# EasyEDA Pro project 一体板.epro, schematic Schematic2
Create Date: 2023-07-03; Page Name: P1; Project Name: 独轮车七月; Schematic Name: Schematic2; Update Date: 2023-07-03; Company: 嘉立创EDA; Page Size: A4; Version: V1.0
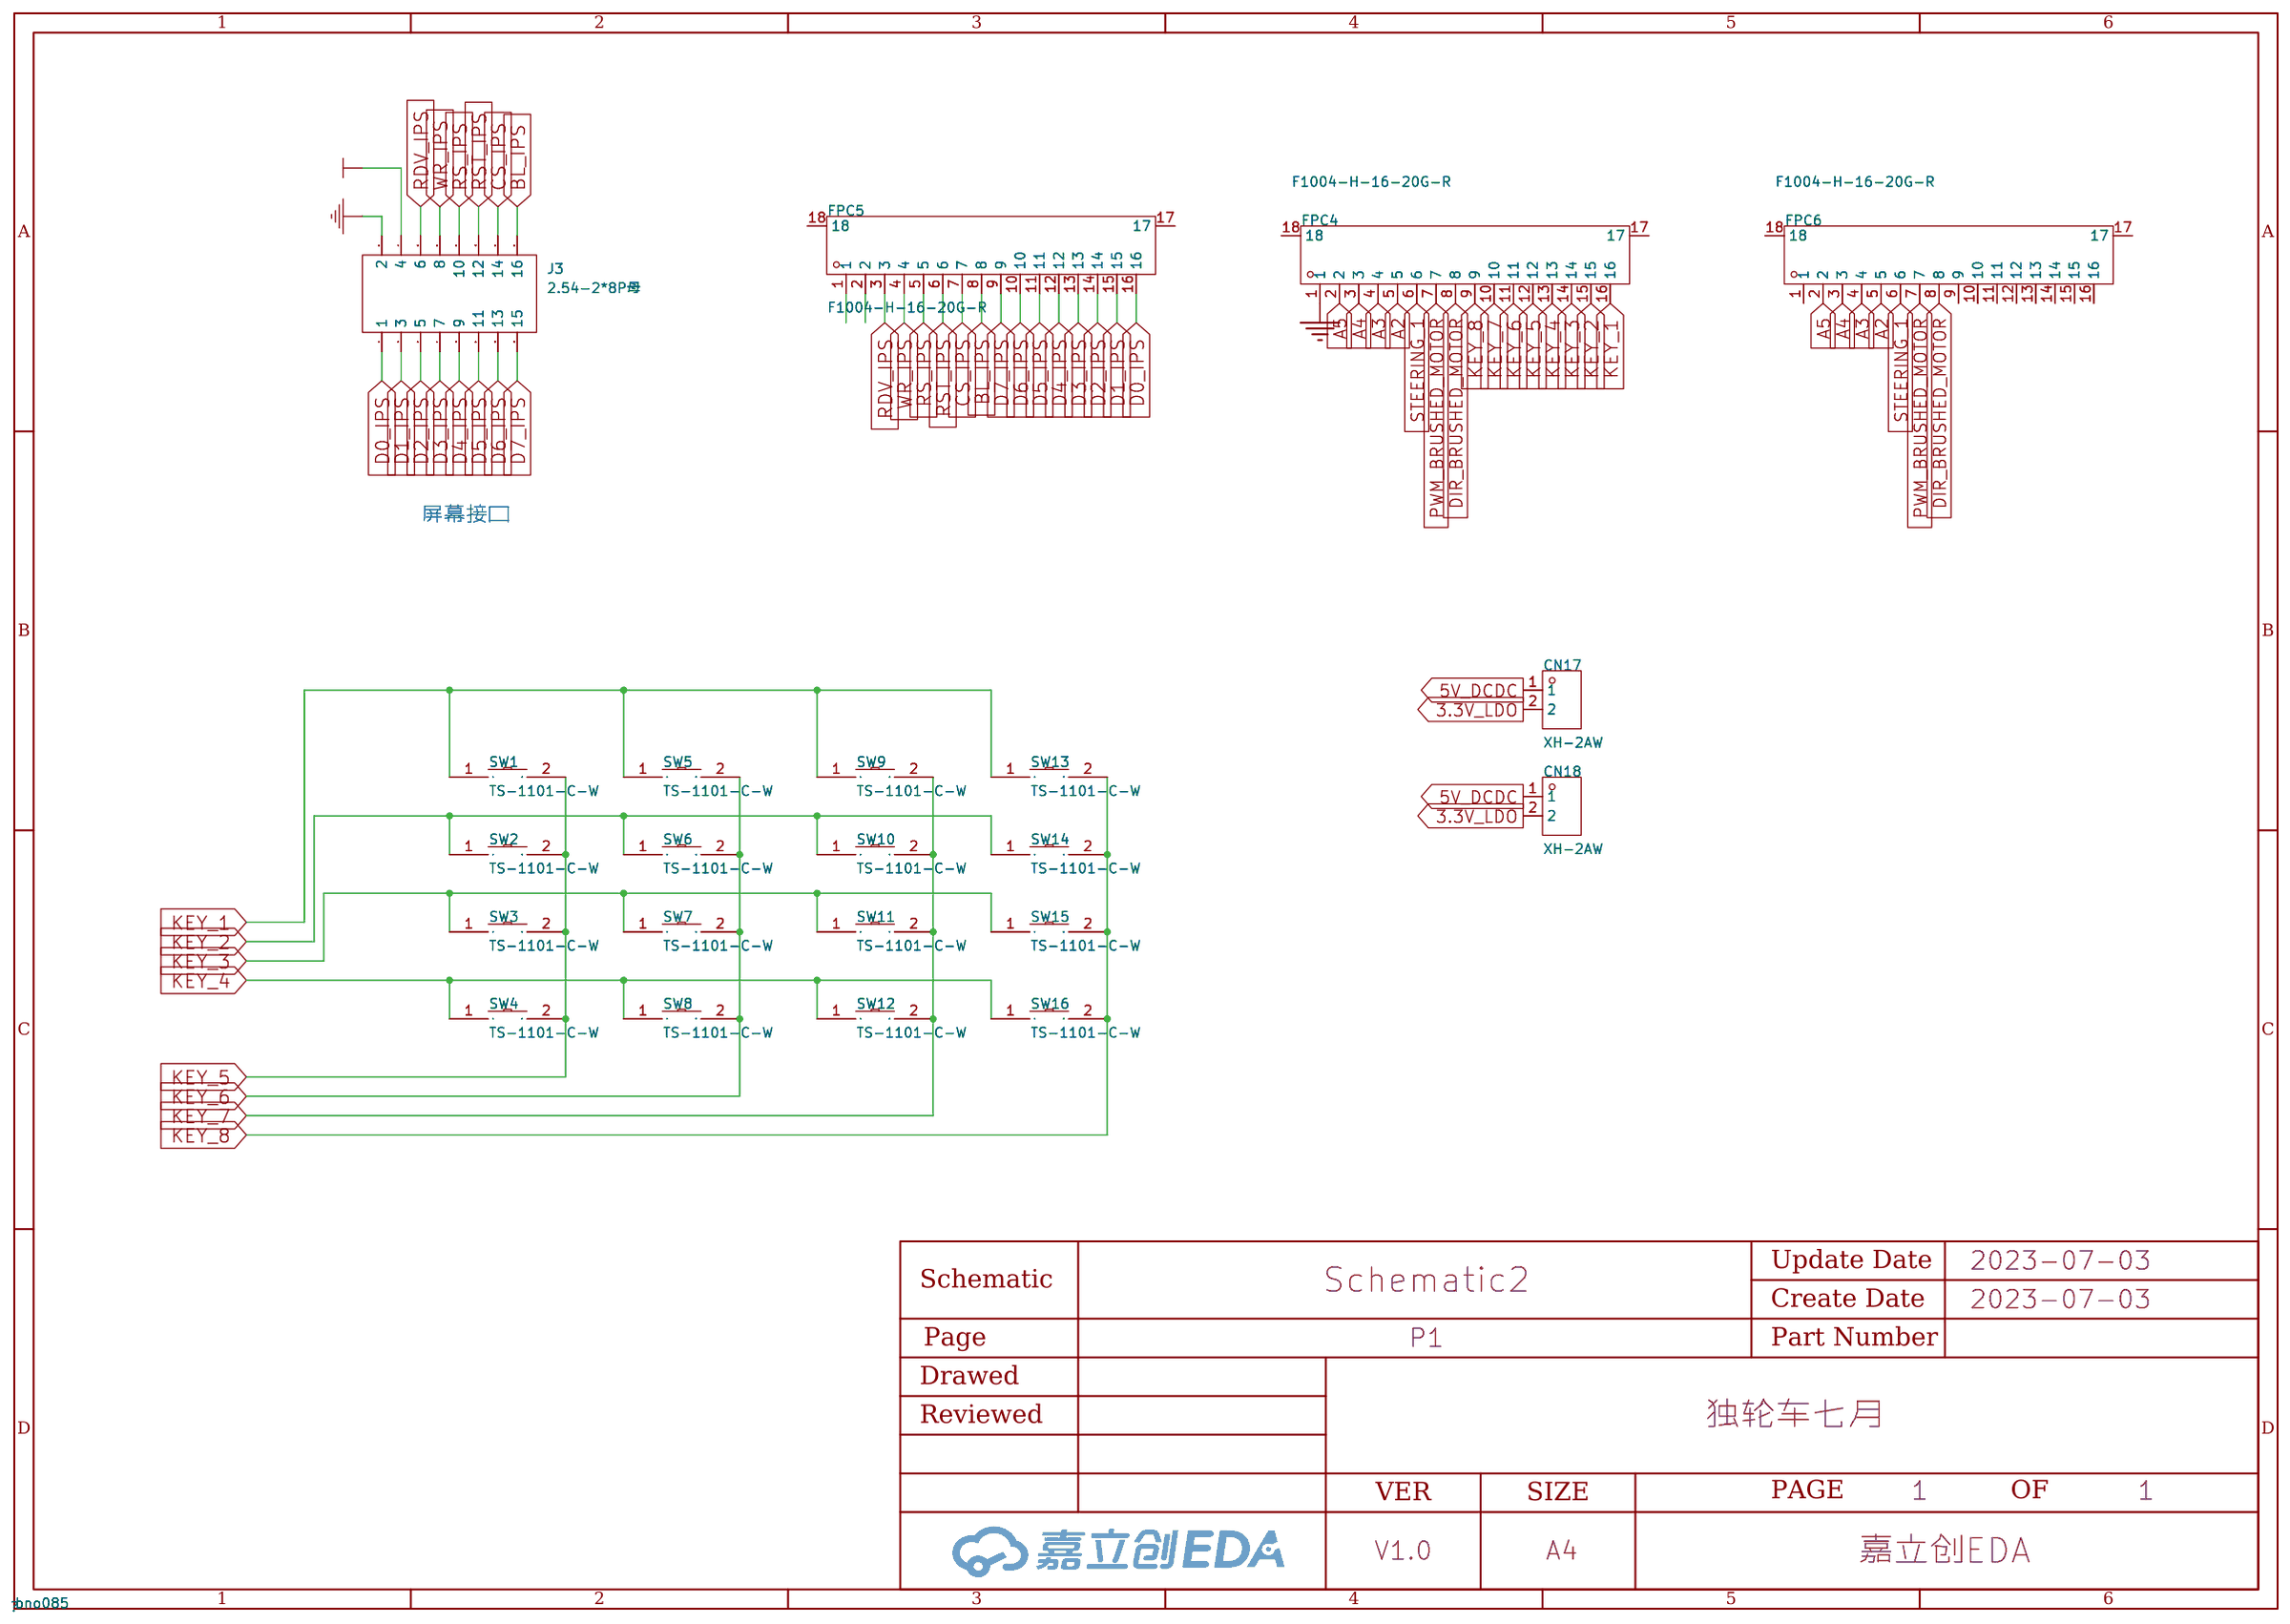
[diagram p2: schematic sheet]

## Parts
CN17  XH-2AW  [CONN-TH_XH-2AW_C2908611]
CN18  XH-2AW  [CONN-TH_XH-2AW_C2908611]
FPC4  F1004-H-16-20G-R  [CONN-SMD_F1004-H-16-20G-R]
FPC5  F1004-H-16-20G-R  [CONN-SMD_F1004-H-16-20G-R]
FPC6  F1004-H-16-20G-R  [CONN-SMD_F1004-H-16-20G-R]
J3  2.54-2*8P母  [HDR-TH_16P-P2.54-V-F-R2-C8-S2.54-1]
SW1  TS-1101-C-W  [SW-SMD_L6.0-W3.3-LS8.0]
SW2  TS-1101-C-W  [SW-SMD_L6.0-W3.3-LS8.0]
SW3  TS-1101-C-W  [SW-SMD_L6.0-W3.3-LS8.0]
SW4  TS-1101-C-W  [SW-SMD_L6.0-W3.3-LS8.0]
SW5  TS-1101-C-W  [SW-SMD_L6.0-W3.3-LS8.0]
SW6  TS-1101-C-W  [SW-SMD_L6.0-W3.3-LS8.0]
SW7  TS-1101-C-W  [SW-SMD_L6.0-W3.3-LS8.0]
SW8  TS-1101-C-W  [SW-SMD_L6.0-W3.3-LS8.0]
SW9  TS-1101-C-W  [SW-SMD_L6.0-W3.3-LS8.0]
SW10  TS-1101-C-W  [SW-SMD_L6.0-W3.3-LS8.0]
SW11  TS-1101-C-W  [SW-SMD_L6.0-W3.3-LS8.0]
SW12  TS-1101-C-W  [SW-SMD_L6.0-W3.3-LS8.0]
SW13  TS-1101-C-W  [SW-SMD_L6.0-W3.3-LS8.0]
SW14  TS-1101-C-W  [SW-SMD_L6.0-W3.3-LS8.0]
SW15  TS-1101-C-W  [SW-SMD_L6.0-W3.3-LS8.0]
SW16  TS-1101-C-W  [SW-SMD_L6.0-W3.3-LS8.0]

## Library data of the parts
CN17 CN18 = XH-2AW_C2908611: 参考系列:XH;间距:2.54mm;插针结构:1x2P;排数:1;每排PIN数:2;行距:-;公母:公型插针;安装方式:弯插;额定电流:3A;工作温度范围:-25℃~+85℃;; LCSC Part Name: XH2.54mm1x2P弯插; Supplier Part: C2908611; Manufacturer: HCTL(华灿天禄); Supplier Footprint: 弯插,P=2.54mm; JLCPCB Part Class: ExtendedPart; Datasheet: https://atta.szlcsc.com/upload/public/pdf/source/20211021/ACA2D54D99493880102FCACAC8DAABA8.pdf; Supplier: LCSC; Reference Series: XH; Pitch: 2.54mm; Pins Structure: 1x2P; Number of Rows: 1; Number of PINs Per Row: 2; Gender: 公型插针; Mounting Style: 弯插; Current Rating (Max): 3A; Operating Temperature Range: -25℃~+85℃
FPC4-FPC6 = F1004-H-16-20G-R: 间距:1mm;触点数量:16P;锁定特性:翻盖式;安装类型:卧贴;触点类型:双侧触点/上下接;; LCSC Part Name: 1mmP数:16P翻盖式双侧触点/上下接; Supplier Part: C668118; Manufacturer: XFCN(兴飞); Supplier Footprint: SMD,P=1mm; JLCPCB Part Class: ExtendedPart; Datasheet: https://atta.szlcsc.com/upload/public/pdf/source/20200618/C668118_823AC902B97FF0E52163AB5BF80076C2.pdf; Supplier: LCSC; Pitch: 1mm; Number of Contacts: 16P; Locking Feature: 翻盖式; Mounting Type: 卧贴; Contact Type: 双侧触点/上下接; Height Above Board: 2mm; FFC, FCB Thickness: 0.3mm
J3 = 2.54-2*8P母: 间距:2.54mm;总孔位数:16;排数:2;插孔结构:2x8P;行距:2.54mm;安装类型:直插;塑高:-;触头材质:黄铜;触头镀层:-;; LCSC Part Name: 2.54mm2x8P; Supplier Part: C30734; Manufacturer: BOOMELE(博穆精密); Supplier Footprint: 直插,P=2.54mm; JLCPCB Part Class: ExtendedPart; Datasheet: https://atta.szlcsc.com/upload/public/pdf/source/20151109/1457707555924.pdf; Supplier: LCSC; Pitch: 2.54mm; Number of Holes: 16; Number of Rows: 2; Holes Structure: 2x8P; Row Spacing: 2.54mm; Mounting Type: 直插; Contact Material: 黄铜
SW1-SW16 = TS-1101-C-W: 触点电流:50mA;额定电压(AC):-;额定电压(DC):12V;额定功率:-;绝缘电阻:-;电路结构:单刀单掷;安装方式:立贴;带灯:无;作用力:260gf;机械寿命:5万次;带支架:否;; LCSC Part Name: 立贴6*3.6*2.5mm轻触开关一型3*6*2.5有白ZDb拉伸白色带淡绿按键卷装; Supplier Part: C318938; Manufacturer: XKBConnectivity(中国星坤); Supplier Footprint: SMD; JLCPCB Part Class: ExtendedPart; Datasheet: https://atta.szlcsc.com/upload/public/pdf/source/20200227/C318938_C2E53B1EEDE37D980A33616AC086DE53.pdf; Supplier: LCSC; Contact Current: 50mA; Voltage Rating (DC): 12V; Circuit: 单刀单掷; Mounting Style: 立贴; Actuator Style: 矩形按钮; Actuator/Cap Color: 白色带淡绿; With Lamp: 无; Operating Force: 260gf; Mechanical Life: 5万次; Operating Temperature: -30℃~+85℃; Switch Length: 6mm; Switch Width: 3.6mm; Switch Height: 2.5mm; Strike Gundam: 否

## Nets
3.3V_LDO: CN17.2 CN18.2 J3.4
5V_DCDC: CN17.1 CN18.1
GND: FPC4.1 J3.2
A2: FPC4.5 FPC6.5
A3: FPC4.4 FPC6.4
A4: FPC4.3 FPC6.3
A5: FPC4.2 FPC6.2
BL_IPS: FPC5.8 J3.16
CS_IPS: FPC5.7 J3.14
D0_IPS: FPC5.16 J3.1
D1_IPS: FPC5.15 J3.3
D2_IPS: FPC5.14 J3.5
D3_IPS: FPC5.13 J3.7
D4_IPS: FPC5.12 J3.9
D5_IPS: FPC5.11 J3.11
D6_IPS: FPC5.10 J3.13
D7_IPS: FPC5.9 J3.15
DIR_BRUSHED_MOTOR: FPC4.8 FPC6.8
KEY_1: FPC4.16 SW1.1 SW5.1 SW9.1 SW13.1
KEY_2: FPC4.15 SW2.1 SW6.1 SW10.1 SW14.1
KEY_3: FPC4.14 SW3.1 SW7.1 SW11.1 SW15.1
KEY_4: FPC4.13 SW4.1 SW8.1 SW12.1 SW16.1
KEY_5: FPC4.12 SW1.2 SW2.2 SW3.2 SW4.2
KEY_6: FPC4.11 SW5.2 SW6.2 SW7.2 SW8.2
KEY_7: FPC4.10 SW9.2 SW10.2 SW11.2 SW12.2
KEY_8: FPC4.9 SW13.2 SW14.2 SW15.2 SW16.2
PWM_BRUSHED_MOTOR: FPC4.7 FPC6.7
RDV_IPS: FPC5.3 J3.6
RS_IPS: FPC5.5 J3.10
RST_IPS: FPC5.6 J3.12
STEERING_1: FPC4.6 FPC6.6
WR_IPS: FPC5.4 J3.8

Not connected (* = marked no-connect by the designer): FPC4 17 18; FPC5 1 2 17 18; FPC6 1 9 10 11 12 13 14 15 16 17 18

## Notes on the sheet
- 屏幕接口
